# EAGLE design button_bit (EAGLE 6.1)
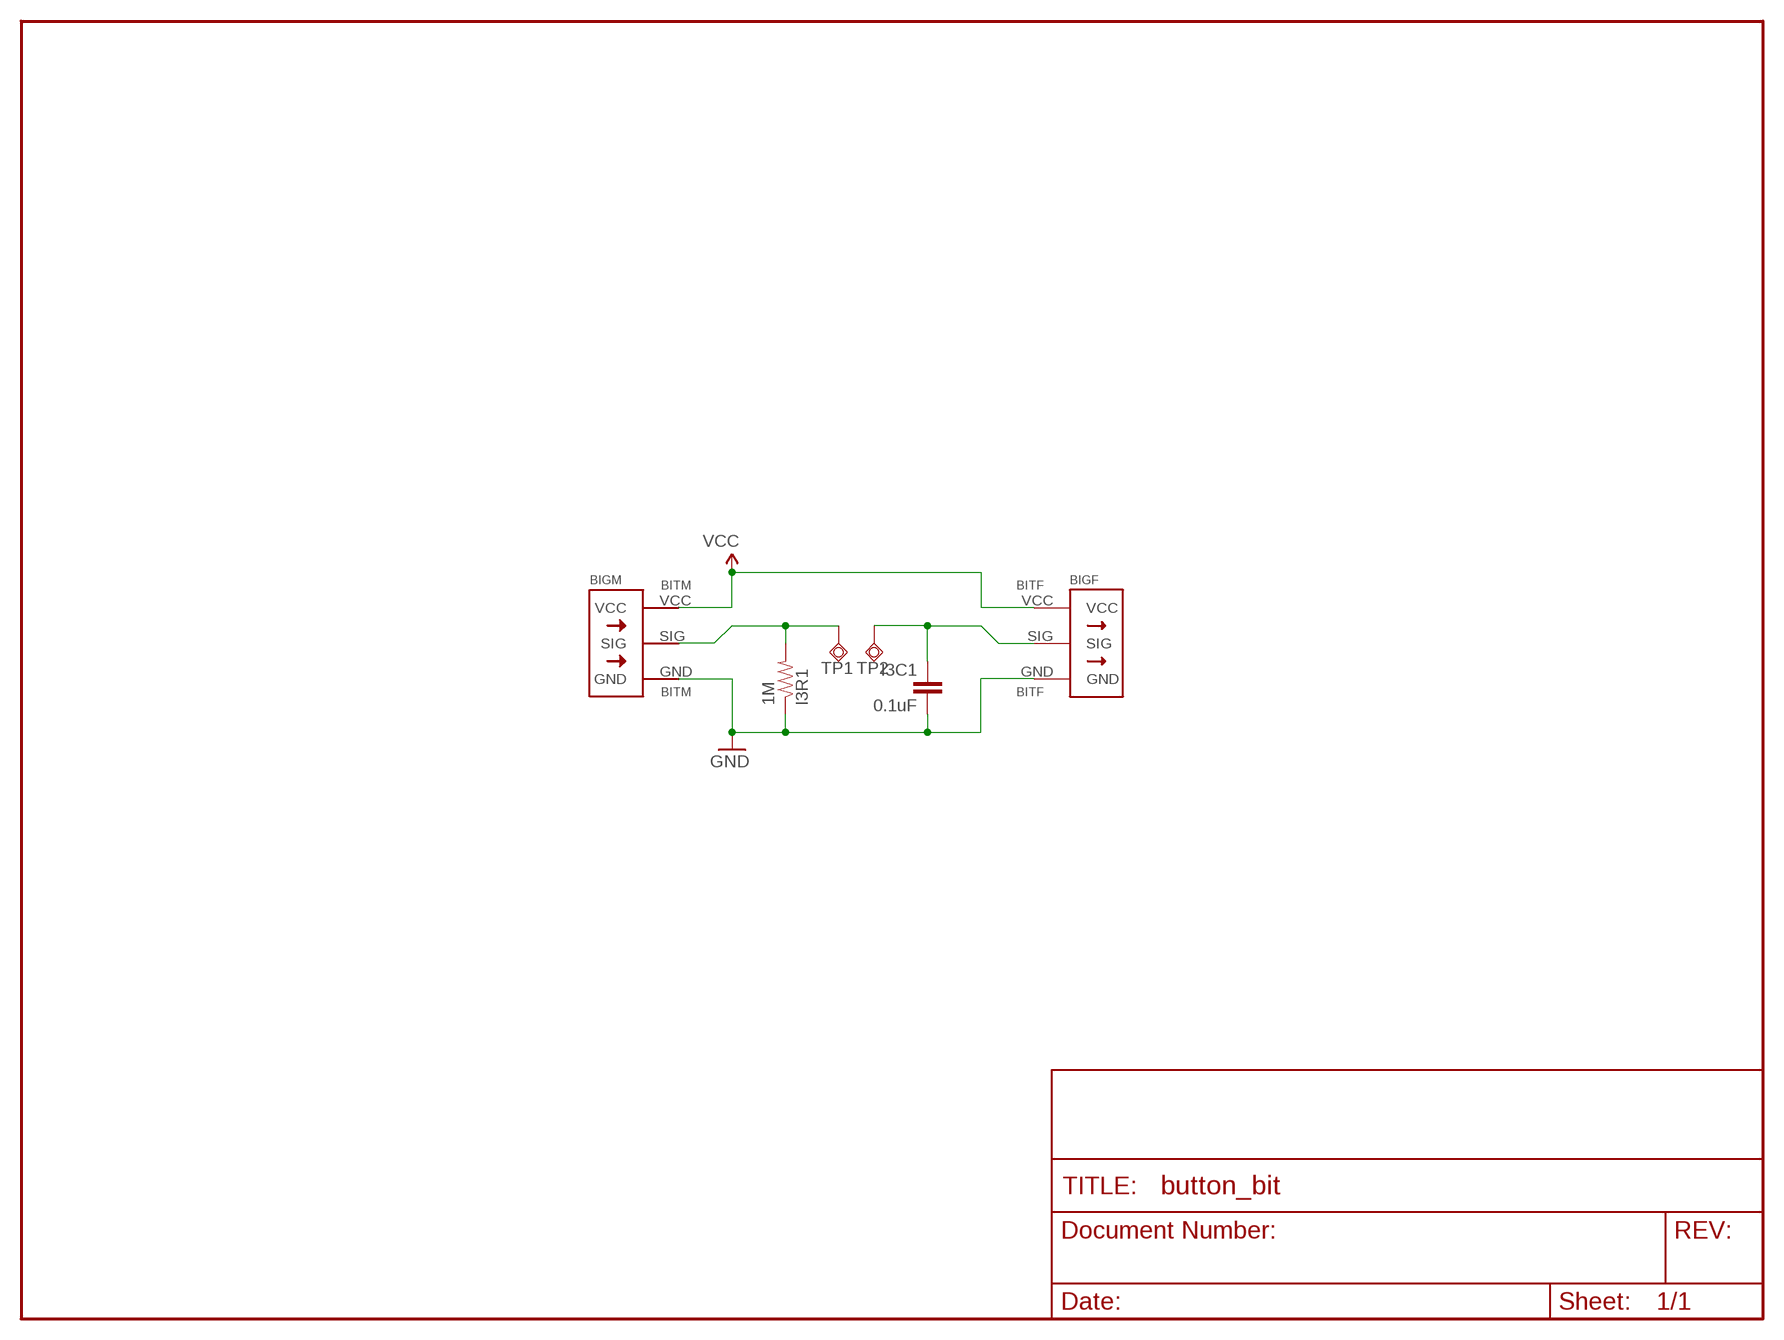
[diagram p0: schematic, sheet 1]

## Parts
BITF  BITF  [BITM]
BITM  BITM  [BITM]
I3C1  0.1uF  CAP1206  [1206]
I3R1  1M  RESISTOR0603-RES  [0603-RES]
TP1  TPSQTP20SQ  [TP20SQ]
TP2  TPSQTP20SQ  [TP20SQ]

## Nets
GND: BITF.GND BITM.GND I3C1.2 I3R1.1
SIG: BITM.SIG I3R1.2 TP1.TP
SIG2: BITF.SIG I3C1.1 TP2.TP
VCC: BITF.VCC BITM.VCC

## Library data of the parts
BITF = radames:BITF
BITM = radames:BITM
I3C1 = SparkFun:CAP: Capacitor Standard 0603 ceramic capacitor, and 0.1" leaded capacitor.
I3R1 = SparkFun:RESISTOR: Resistor Basic schematic elements and footprints for 0603, 1206, and PTH 1/10th watt (small) resistors.
TP1 TP2 = testpad:TPSQ: Test pad

## Board
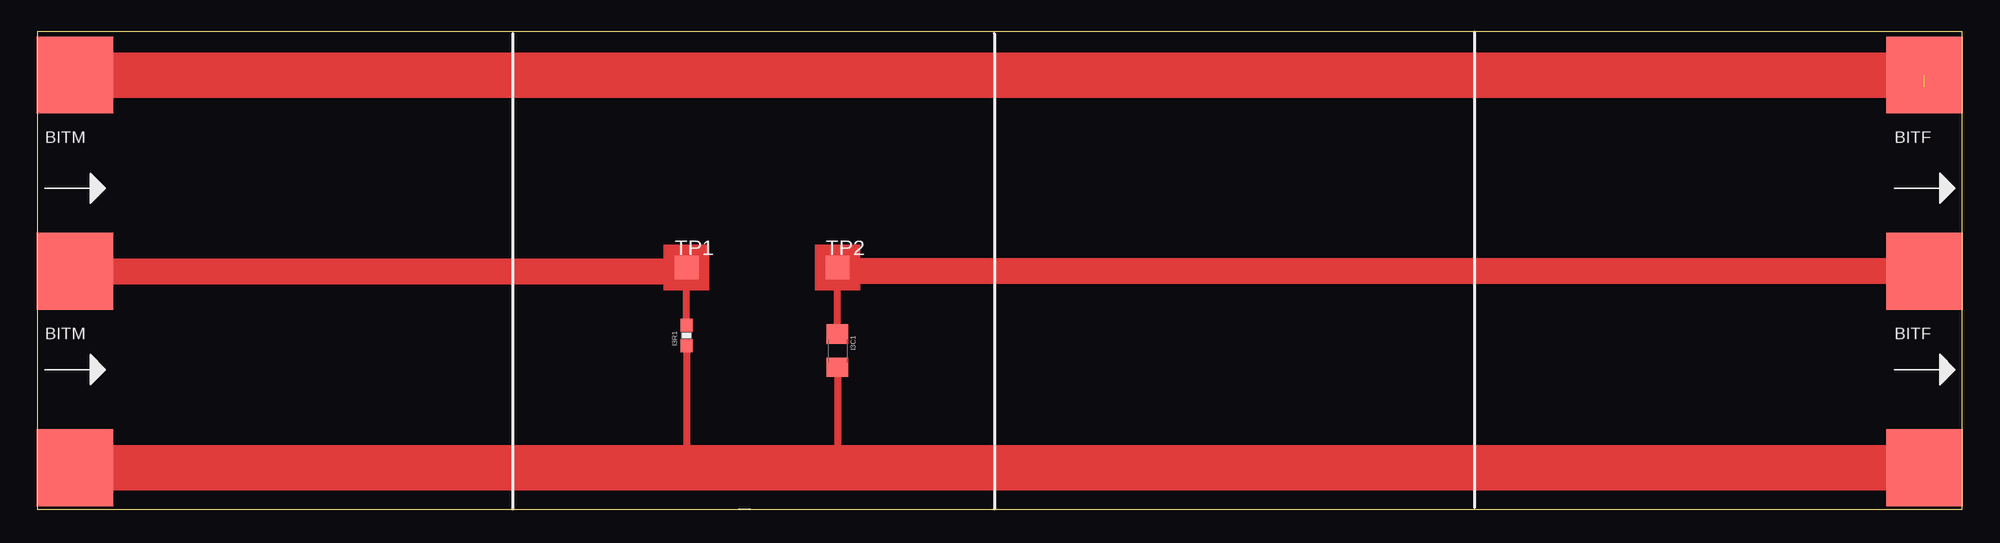
[diagram p1: board, top side]

Size 161.91 x 40.16 mm. Coordinates in mm from the lower left corner, seen from the top.
Outline: 0,0 161.91,0 161.91,40.16 0,40.16 0,0
Copper layers (1*16): Top 0.035mm / dielectric 1.5mm / Bottom 0.035mm
Design rules: minimum track width 10mil, minimum drill 24mil, track to track 8mil, track to pad 8mil, pad to pad 8mil, via to via 8mil, smd to smd 8mil, copper to edge 40mil, drill to drill 8mil, minimum pad ring 10mil, minimum via ring 8mil, stop-mask expansion 4mil, vias tented up to drill 0mil, thermal gap 10mil

### Footprints (pad centres in the part's own frame; a part is rotated, then mirrored left to right if it is on the bottom)
BITM = smd 6.452 x 6.452: GND 3.175,-16.192; SIG 3.175,0.318; VCC 3.175,16.828
1206 = smd 1.6 x 1.8: 1 -1.4,0; 2 1.4,0
0603-RES = smd 1.1 x 1: 1 -0.85,0; 2 0.85,0
TP20SQ = smd 2 x 2: TP 0,0

### Placement (x,y rotation side)
BITF  155.58,19.69 0 top
BITM  0,19.69 0 top
I3C1  67.31,13.33 270 top
I3R1  54.61,14.6 90 top
TP1  54.61,20.32 0 top
TP2  67.31,20.32 0 top

### Tracks (layer width: path | path; a pad name or v marks a point on that pad's centre or on a via)
GND
  Top 0.61: I3C1.2 67.31,3.49 67.31,2.54 | I3R1.1 54.61,3.49
  Top 3.81: BITF.GND 67.31,3.49 54.61,3.49 BITM.GND
SIG
  Top 0.61: I3R1.2 TP1.TP 54.61,20
  Top 2.184: BITM.SIG 54.61,20
SIG2
  Top 0.61: I3C1.1 TP2.TP 67.31,20
  Top 2.184: BITF.SIG 67.31,20
VCC  (1 unrouted)
  Top 3.81: BITM.VCC BITF.VCC 158.75,35.56
(copper drawn outside any net)
  shapes: Top area x2